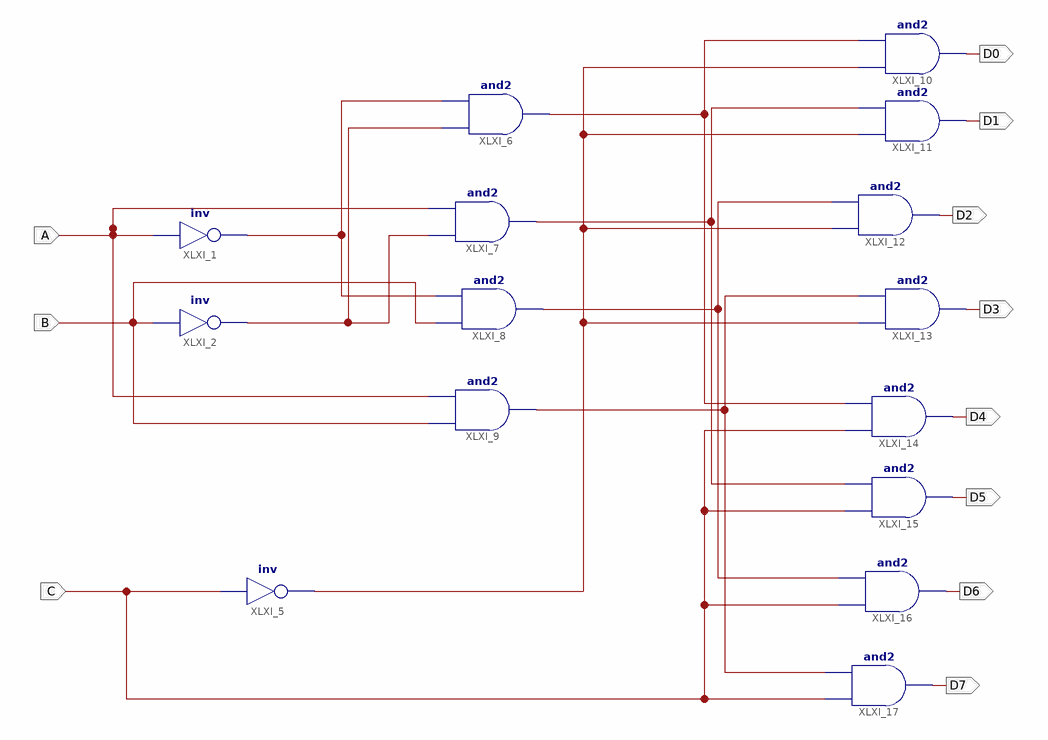
[diagram p0: schematic sheet 1]
// Xilinx ISE schematic Decoder_38_sch.sch (kintex7) as structural Verilog: 15 symbols, 11 ports
module Decoder_38_sch (
  input  A,
  input  B,
  input  C,
  output D0,
  output D1,
  output D2,
  output D3,
  output D4,
  output D5,
  output D6,
  output D7
);

  wire XLXN_12, XLXN_13, XLXN_17, XLXN_18, XLXN_19, XLXN_20, XLXN_25;

  not XLXI_1 (XLXN_12, A);
  not XLXI_2 (XLXN_13, B);
  not XLXI_5 (XLXN_25, C);
  and XLXI_6 (XLXN_17, XLXN_13, XLXN_12);
  and XLXI_7 (XLXN_18, XLXN_13, A);
  and XLXI_8 (XLXN_19, B, XLXN_12);
  and XLXI_9 (XLXN_20, B, A);
  and XLXI_10 (D0, XLXN_25, XLXN_17);
  and XLXI_11 (D1, XLXN_25, XLXN_18);
  and XLXI_12 (D2, XLXN_25, XLXN_19);
  and XLXI_13 (D3, XLXN_25, XLXN_20);
  and XLXI_14 (D4, C, XLXN_17);
  and XLXI_15 (D5, C, XLXN_18);
  and XLXI_16 (D6, C, XLXN_19);
  and XLXI_17 (D7, C, XLXN_20);
endmodule
